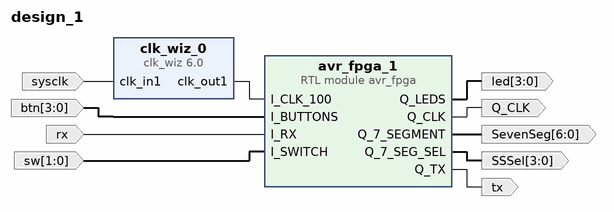
[diagram p0: block diagram of the top level]
# Vivado block design design_1, xc7z020clg400-1, Vivado 2021.1
create_bd_design design_1

create_bd_port -dir I -type clk sysclk
set_property -dict {CONFIG.ASSOCIATED_RESET sw CONFIG.FREQ_HZ 125000000} [get_bd_ports sysclk]
create_bd_port -dir O -from 3 -to 0 led
create_bd_port -dir O -from 6 -to 0 SevenSeg
create_bd_port -dir I rx
create_bd_port -dir O tx
create_bd_port -dir I -from 1 -to 0 sw
create_bd_port -dir I -from 3 -to 0 btn
create_bd_port -dir O -from 3 -to 0 SSSel
create_bd_port -dir O -type clk Q_CLK
set_property -dict {CONFIG.FREQ_HZ 25000000} [get_bd_ports Q_CLK]

create_bd_cell -type ip -vlnv xilinx.com:ip:clk_wiz:6.0 clk_wiz_0
set_property -dict [list \
  CONFIG.CLKIN1_JITTER_PS 80.0 \
  CONFIG.CLKOUT1_JITTER 312.659 \
  CONFIG.CLKOUT1_PHASE_ERROR 245.713 \
  CONFIG.CLKOUT1_REQUESTED_OUT_FREQ 25 \
  CONFIG.MMCM_CLKFBOUT_MULT_F 36.500 \
  CONFIG.MMCM_CLKIN1_PERIOD 8.000 \
  CONFIG.MMCM_CLKOUT0_DIVIDE_F 36.500 \
  CONFIG.MMCM_DIVCLK_DIVIDE 5 \
  CONFIG.PRIM_IN_FREQ 125 \
  CONFIG.USE_LOCKED false \
  CONFIG.USE_RESET false \
] [get_bd_cells clk_wiz_0]
create_bd_cell -type module -reference avr_fpga avr_fpga_1

# ---- connections ----

connect_bd_net [get_bd_pins avr_fpga_1/Q_7_SEGMENT] [get_bd_ports SevenSeg]
connect_bd_net [get_bd_pins avr_fpga_1/Q_7_SEG_SEL] [get_bd_ports SSSel]
connect_bd_net [get_bd_pins avr_fpga_1/Q_CLK] [get_bd_ports Q_CLK]
connect_bd_net [get_bd_pins avr_fpga_1/Q_LEDS] [get_bd_ports led]
connect_bd_net [get_bd_pins avr_fpga_1/Q_TX] [get_bd_ports tx]
connect_bd_net [get_bd_ports btn] [get_bd_pins avr_fpga_1/I_BUTTONS]
connect_bd_net [get_bd_pins clk_wiz_0/clk_out1] [get_bd_pins avr_fpga_1/I_CLK_100]
connect_bd_net [get_bd_ports rx] [get_bd_pins avr_fpga_1/I_RX]
connect_bd_net [get_bd_ports sw] [get_bd_pins avr_fpga_1/I_SWITCH]
connect_bd_net [get_bd_ports sysclk] [get_bd_pins clk_wiz_0/clk_in1]

validate_bd_design
save_bd_design
